# Altium schematic sheet 转速检测.SchDoc
size A4
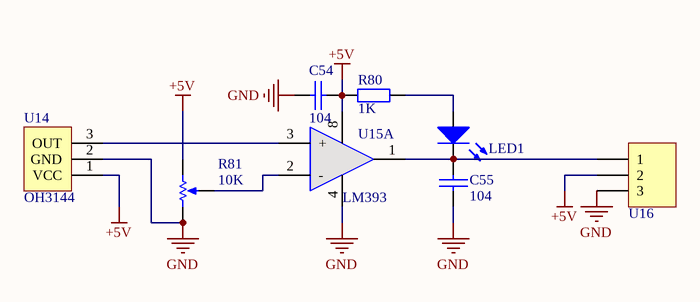
[diagram p0: 转速检测.SchDoc]

## Parts
C54  104  [0603C]
C55  104  [0603C]
LED1  COLOUR  [0603LED]  (value not drawn)
R80  value 1K  [0603-1]  (hidden comment: Res1)
R81  value 10K  [3x3dianweiqi]  (hidden comment: RPot)
U14  OH3144  [OH3144]
U15  LM393  [NSO8_N]  (part A of 2)
U16  Header 3  [HDR3X1_A]  (value not drawn)

## Nets
+5V: C54.2 R80.1 R81.3(BOT) U14.1(VCC) U15.8(V+) U16.2
GND: C54.1 C55.1 R81.1(TOP) U14.2(GND) U15.4(V-) U16.3
NetC55_2: C55.2 LED1.2(-) U15.1(OUT1) U16.1
NetLED1_1: LED1.1(+) R80.2
NetR81_2: R81.2(TAP) U15.2(-)
NetU14_3: U14.3(OUT) U15.3(+)

## Library data of the parts
C54 C55 = CAP X: 安规电容
LED1 = ledφ6
R80 = Res1: 贴片电阻; Published: 8-Jun-2000; LatestRevisionDate: 17-Jul-2002; LatestRevisionNote: Re-released for DXP Platform.; PackageReference: AXIAL-0.4; Publisher: Altium Limited
R81 = RPot: 精密可调电阻; Sim Note: Enter the Resistance value and the set point into parameter fields.; Set Position: 0.5; Published: 8-Jun-2000; LatestRevisionDate: 17-Jul-2002; LatestRevisionNote: Re-released for DXP Platform.; PackageReference: VR5; Publisher: Altium Limited
U14 = OH3144: 国产霍尔开关
U15 = LM393: 比较器
U16 = Header 3: 接插件; LatestRevisionDate: 17-Jul-2002; LatestRevisionNote: Re-released for DXP Platform.; Publisher: Altium Limited